# EAGLE design gate_driver (EAGLE 9.1.0)
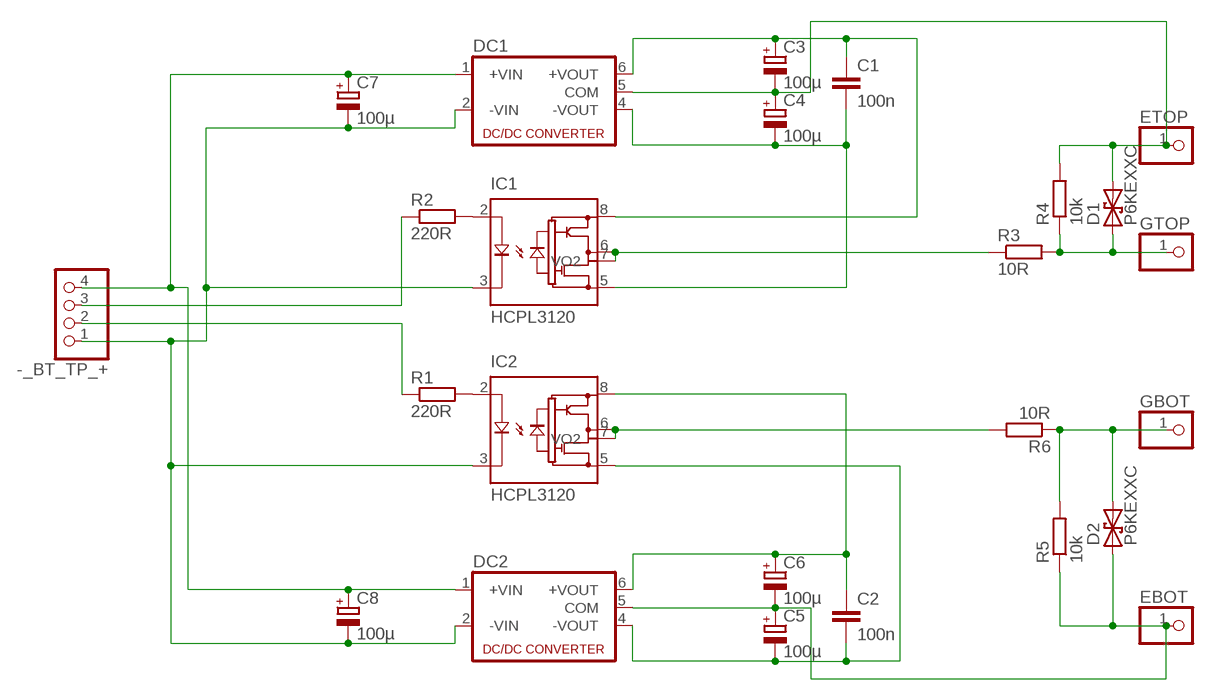
[diagram p0: schematic, sheet 1]

## Parts
-_BT_TP_+  PINHD-1X4  [1X04]
C1  100n  C-EU050-025X075  [C050-025X075]
C2  100n  C-EU050-025X075  [C050-025X075]
C3  100µ  CPOL-EUE2,5-6E  [E2,5-6E]
C4  100µ  CPOL-EUE2,5-6E  [E2,5-6E]
C5  100µ  CPOL-EUE2,5-6E  [E2,5-6E]
C6  100µ  CPOL-EUE2,5-6E  [E2,5-6E]
C7  100µ  CPOL-EUE2.5-5  [E2,5-5]
C8  100µ  CPOL-EUE2.5-5  [E2,5-5]
D1  P6KEXXC  [CB417-15]
D2  P6KEXXC  [CB417-15]
DC1  NMA  [NMA]
DC2  NMA  [NMA]
EBOT  PINHD-1X1  [1X01]
ETOP  PINHD-1X1  [1X01]
GBOT  PINHD-1X1  [1X01]
GTOP  PINHD-1X1  [1X01]
IC1  HCPL3120  [DIL08]
IC2  HCPL3120  [DIL08]
R1  220R  R-EU_0207/10  [0207/10]
R2  220R  R-EU_0207/10  [0207/10]
R3  10R  R-EU_0309/12  [0309/12]
R4  10k  R-EU_0207/10  [0207/10]
R5  10k  R-EU_0207/10  [0207/10]
R6  10R  R-EU_0309/12  [0309/12]

## Nets
EBOT: C5.+ C6.- D2.A DC2.5(COM) EBOT.1 R5.1
ETOP: C3.- C4.+ D1.C DC1.5(COM) ETOP.1 R4.2
GBOT: D2.C GBOT.1 R5.2 R6.1
GND: -_BT_TP_+.1 C7.- C8.- DC1.2(-VIN) DC2.2(-VIN) IC1.3(CATHODE) IC2.3(CATHODE)
GTOP: D1.A GTOP.1 R3.2 R4.1
N$1: IC2.2(ANODE) R1.2
N$2: IC1.2(ANODE) R2.2
N$5: C1.2 C4.- DC1.4(-VOUT) IC1.5(VEE)
N$6: C1.1 C3.+ DC1.6(+VOUT) IC1.8(VCC)
N$7: C2.1 C6.+ DC2.6(+VOUT) IC2.8(VCC)
N$8: C2.2 C5.- DC2.4(-VOUT) IC2.5(VEE)
N$9: IC1.6(VO) IC1.7(VO2) R3.1
N$10: IC2.6(VO) IC2.7(VO2) R6.2
N$15: -_BT_TP_+.4 C7.+ C8.+ DC1.1(+VIN) DC2.1(+VIN)
N$17: -_BT_TP_+.3 R2.1
N$18: -_BT_TP_+.2 R1.1

## Library data of the parts
-_BT_TP_+ = pinhead:PINHD-1X4: PIN HEADER
C1 C2 = rcl:C-EU: CAPACITOR, European symbol
C3-C8 = rcl:CPOL-EU: POLARIZED CAPACITOR, European symbol
D1 D2 = diode:P6KEXXC: DIODE transient-voltage suppressor
DC1 DC2 = dc-dc-converter:NMA: DC-DC CONVERTER
EBOT ETOP GBOT GTOP = pinhead:PINHD-1X1: PIN HEADER
IC1 IC2 = optocoupler:HCPL3120
R1-R6 = rcl:R-EU_: RESISTOR, European symbol

## Board
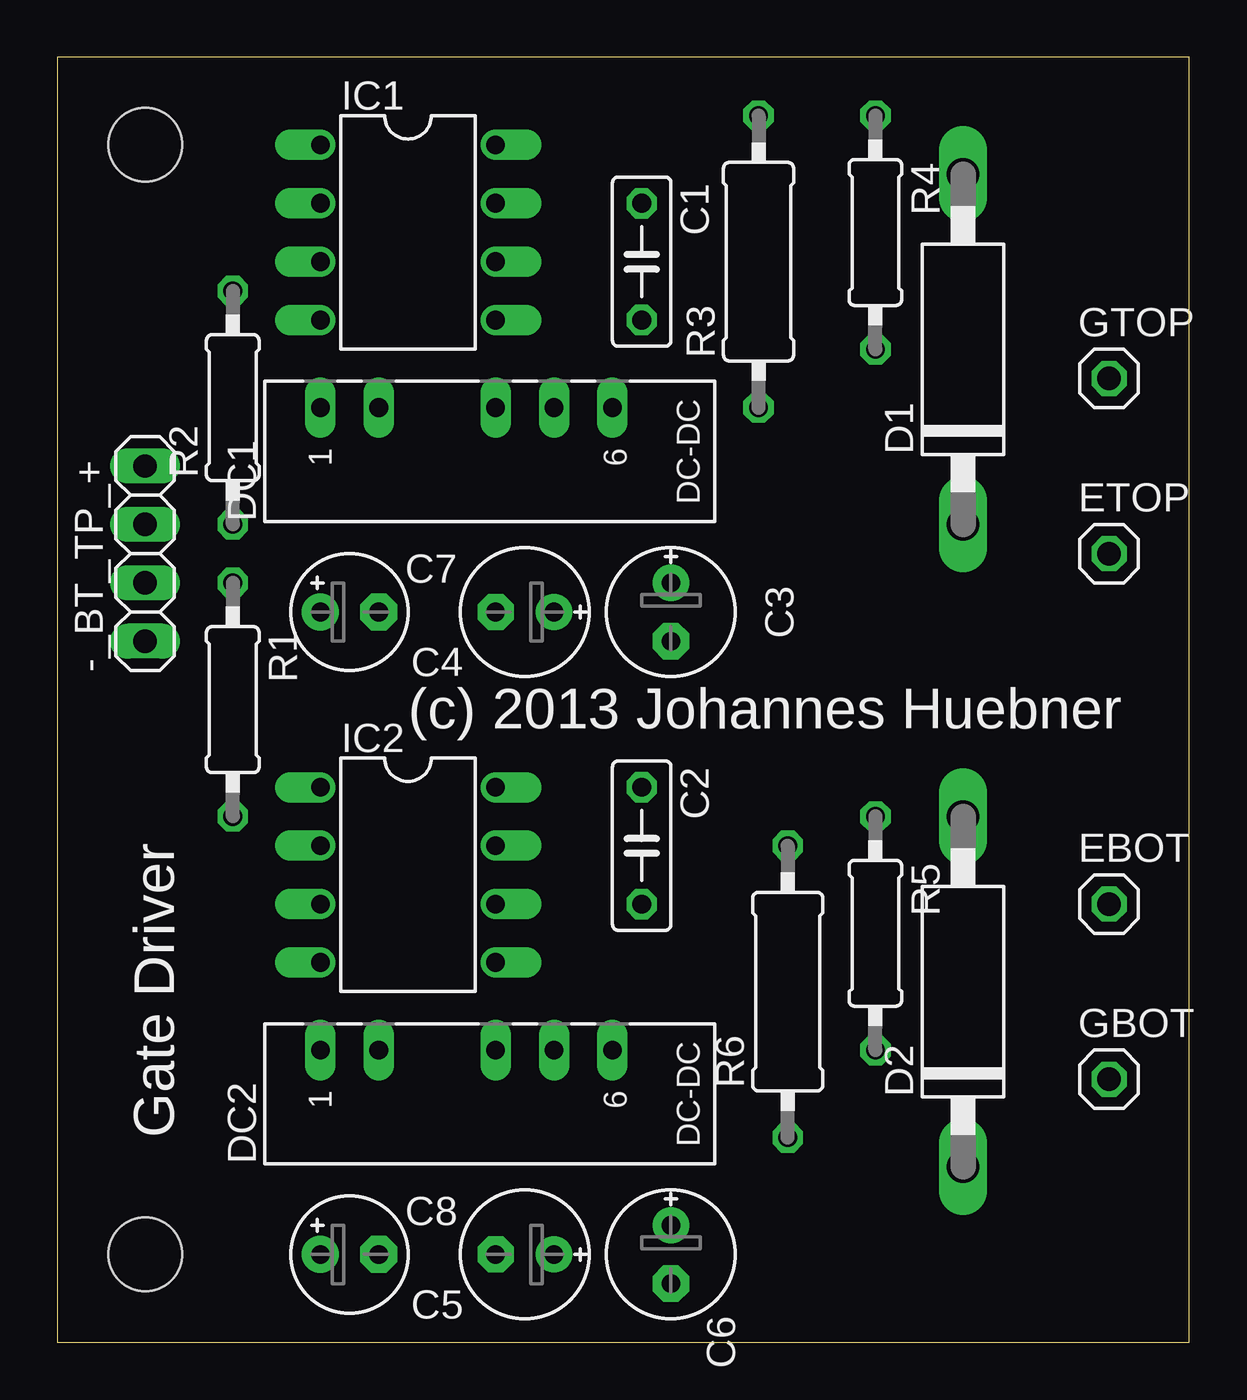
[diagram p1: board, top side]
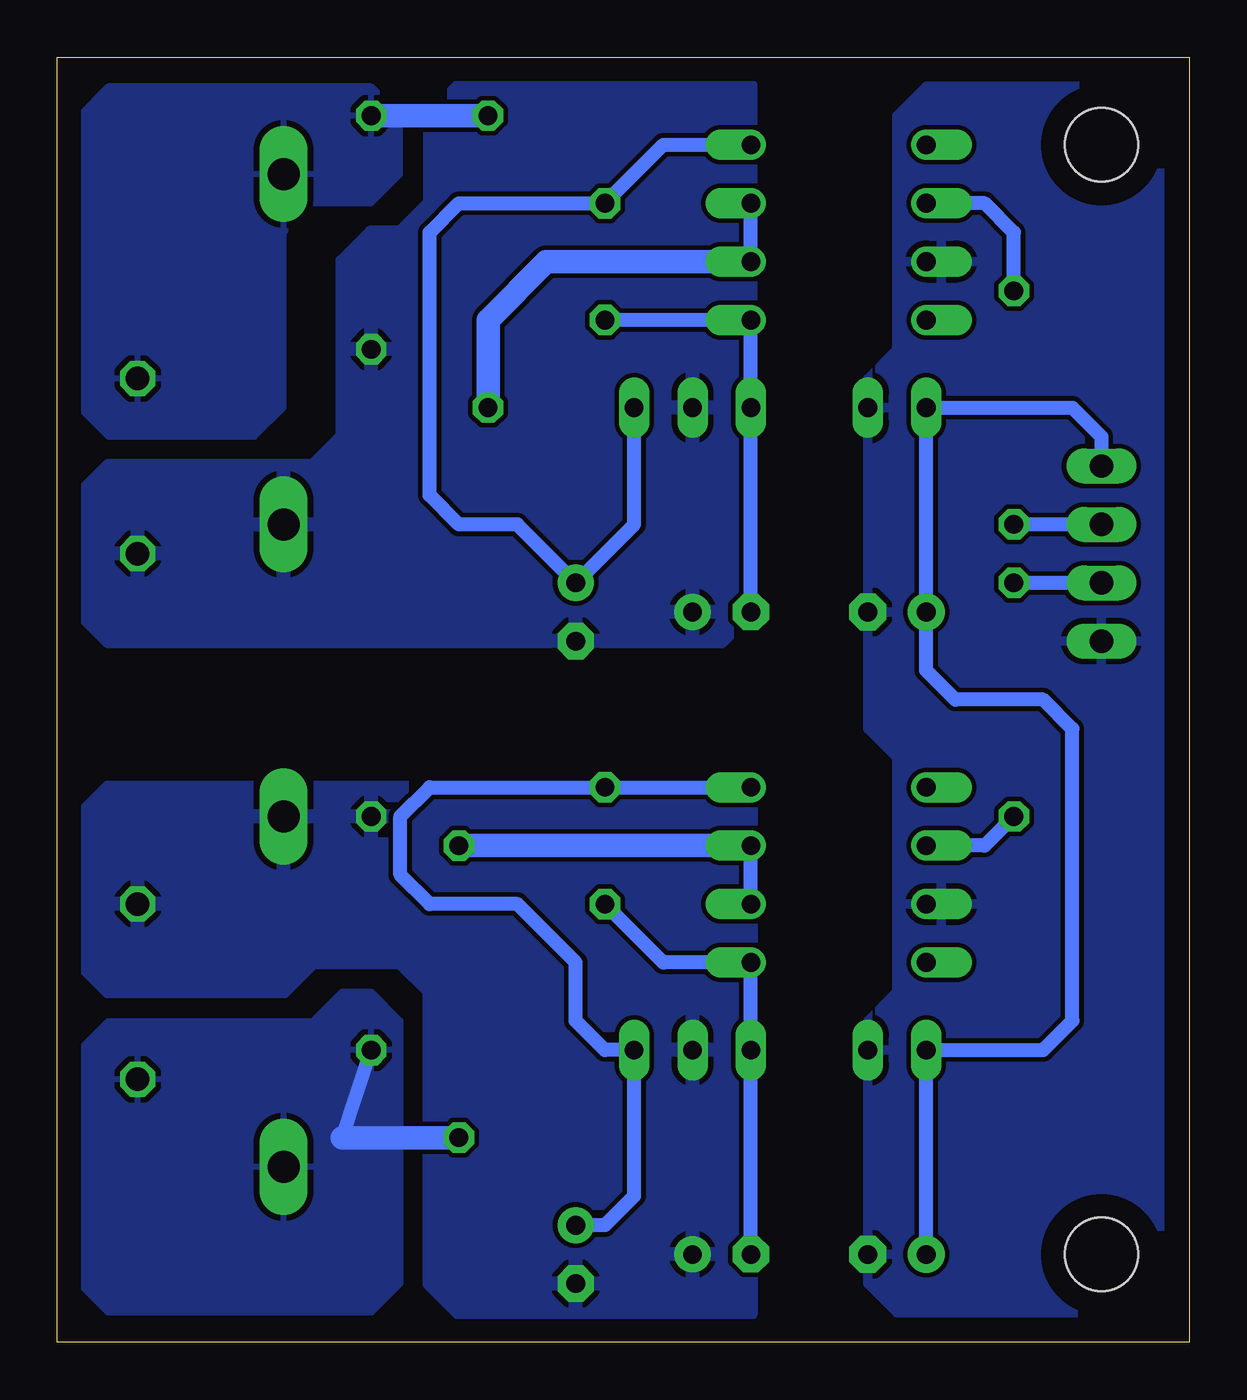
[diagram p2: board, bottom side, seen from below]

Size 49.2 x 55.87 mm. Coordinates in mm from the lower left corner, seen from the top.
Outline: 0,0 49.2,0 49.2,55.87 0,55.87 0,0
Copper layers (1*16): Top 0.035mm / dielectric 1.5mm / Bottom 0.035mm
Design rules "default": minimum track width 10mil, minimum drill 24mil, track to track 8mil, track to pad 8mil, pad to pad 8mil, via to via 8mil, smd to smd 8mil, copper to edge 40mil, drill to drill 8mil, minimum pad ring 10mil, minimum via ring 8mil, stop-mask expansion 4mil, vias tented up to drill 0mil, thermal gap 10mil
Holes 3.2 mm at 3.81,52.07 3.81,3.81

### Footprints (pad centres in the part's own frame; a part is rotated, then mirrored left to right if it is on the bottom)
1X04 = drill 1.016 long: 1 -3.81,0; 2 -1.27,0; 3 1.27,0; 4 3.81,0
C050-025X075 = drill 0.813 octagon: 1 -2.54,0; 2 2.54,0
E2,5-6E = drill 0.813 pad 1.575: + -1.27,0 | drill 0.813 pad 1.575 octagon: - 1.27,0
E2,5-5 = drill 0.813 pad 1.6: + -1.27,0 | drill 0.813 pad 1.6 octagon: - 1.27,0
CB417-15 = drill 1.397 long: A 7.62,0; C -7.62,0
NMA = drill 0.813 long: 1 0,6.35; 2 0,3.81; 4 0,-1.27; 5 0,-3.81; 6 0,-6.35
1X01 = drill 1.016 octagon: 1 0,0
DIL08 = drill 0.813 offset: 1 -3.81,-3.81; 2 -1.27,-3.81; 3 1.27,-3.81; 4 3.81,-3.81; 5 3.81,3.81; 6 1.27,3.81; 7 -1.27,3.81; 8 -3.81,3.81
0207/10 = drill 0.813 octagon: 1 -5.08,0; 2 5.08,0
0309/12 = drill 0.813 octagon: 1 -6.35,0; 2 6.35,0

### Placement (x,y rotation side)
-_BT_TP_+  3.81,34.29 90 top
C1  25.4,46.99 270 top
C2  25.4,21.59 270 top
C3  26.67,31.75 270 top
C4  20.32,31.75 180 top
C5  20.32,3.81 180 top
C6  26.67,3.81 270 top
C7  12.7,31.75 0 top
C8  12.7,3.81 0 top
D1  39.37,43.18 90 top
D2  39.37,15.24 90 top
DC1  17.78,40.64 90 top
DC2  17.78,12.7 90 top
EBOT  45.72,19.05 0 top
ETOP  45.72,34.29 0 top
GBOT  45.72,11.43 0 top
GTOP  45.72,41.91 0 top
IC1  15.24,48.26 270 top
IC2  15.24,20.32 270 top
R1  7.62,27.94 270 top
R2  7.62,40.64 90 top
R3  30.48,46.99 90 top
R4  35.56,48.26 270 top
R5  35.56,17.78 270 top
R6  31.75,15.24 90 top

### Tracks (layer width: path | path; a pad name or v marks a point on that pad's centre or on a via)
EBOT
  pour Bottom: 31.75,1.27 33.02,2.54 33.02,15.24 34.29,16.51 38.1,16.51 39.37,15.24 46.99,15.24 48.26,16.51 48.26,22.86 46.99,24.13 19.05,24.13 19.05,1.27
ETOP
  pour Bottom: 19.05,54.61 31.75,54.61 33.02,53.34 33.02,49.53 34.29,48.26 35.56,48.26 36.83,46.99 36.83,39.37 38.1,38.1 46.99,38.1 48.26,36.83 48.26,31.75 46.99,30.48 20.32,30.48 19.05,31.75
GBOT
  Bottom 0.61: 36.83,8.89 R5.2
  Bottom 1.016: R6.1 36.83,8.89
  pour Bottom: 46.99,13.97 38.1,13.97 36.83,15.24 35.56,15.24 34.29,13.97 34.29,2.54 35.56,1.27 46.99,1.27 48.26,2.54 48.26,12.7
GND
  pour Bottom: 1.27,54.61 11.43,54.61 12.7,53.34 12.7,43.18 13.97,41.91 13.97,26.67 12.7,25.4 12.7,15.24 13.97,13.97 13.97,2.54 12.7,1.27 1.27,1.27
GTOP
  Bottom 1.016: R3.2 R4.1
  pour Bottom: 35.56,54.61 46.99,54.61 48.26,53.34 48.26,40.64 46.99,39.37 40.64,39.37 39.37,40.64 39.37,48.26 38.1,49.53 35.56,49.53 34.29,50.8 34.29,53.34
N$1
  Bottom 0.61: R1.2 8.89,21.59 IC2.2
N$2
  Bottom 0.61: R2.2 7.62,48.26 8.89,49.53 IC1.2
N$5
  Bottom 0.61: C4.- DC1.4 IC1.5 C1.2
N$6
  Bottom 0.61: IC1.8 22.86,52.07 C1.1 31.75,49.53 33.02,48.26 33.02,36.83 31.75,35.56 29.21,35.56 C3.+ 24.13,35.56 DC1.6
N$7
  Bottom 0.61: IC2.8 C2.1 33.02,24.13 34.29,22.86 34.29,20.32 33.02,19.05 29.21,19.05 26.67,16.51 26.67,13.97 25.4,12.7 DC2.6 24.13,6.35 25.4,5.08 C6.+
N$8
  Bottom 0.61: C5.- DC2.4 IC2.5 22.86,16.51 C2.2
N$9
  Bottom 0.61: IC1.6 IC1.7
  Bottom 1.016: IC1.6 27.94,46.99 30.48,44.45 R3.1
N$10
  Bottom 0.61: IC2.6 IC2.7
  Bottom 1.016: IC2.7 R6.2
N$15
  Bottom 0.61: C8.+ DC2.1 6.35,12.7 5.08,13.97 5.08,26.67 6.35,27.94 10.16,27.94 11.43,29.21 C7.+ DC1.1 5.08,40.64 3.81,39.37 -_BT_TP_+.4
N$17
  Bottom 0.61: -_BT_TP_+.3 R2.1
N$18
  Bottom 0.61: -_BT_TP_+.2 R1.1

### Text on the board
tNames: (c) 2013 Johannes Huebner | Gate Driver